# EAGLE design blumote (EAGLE 5.07)
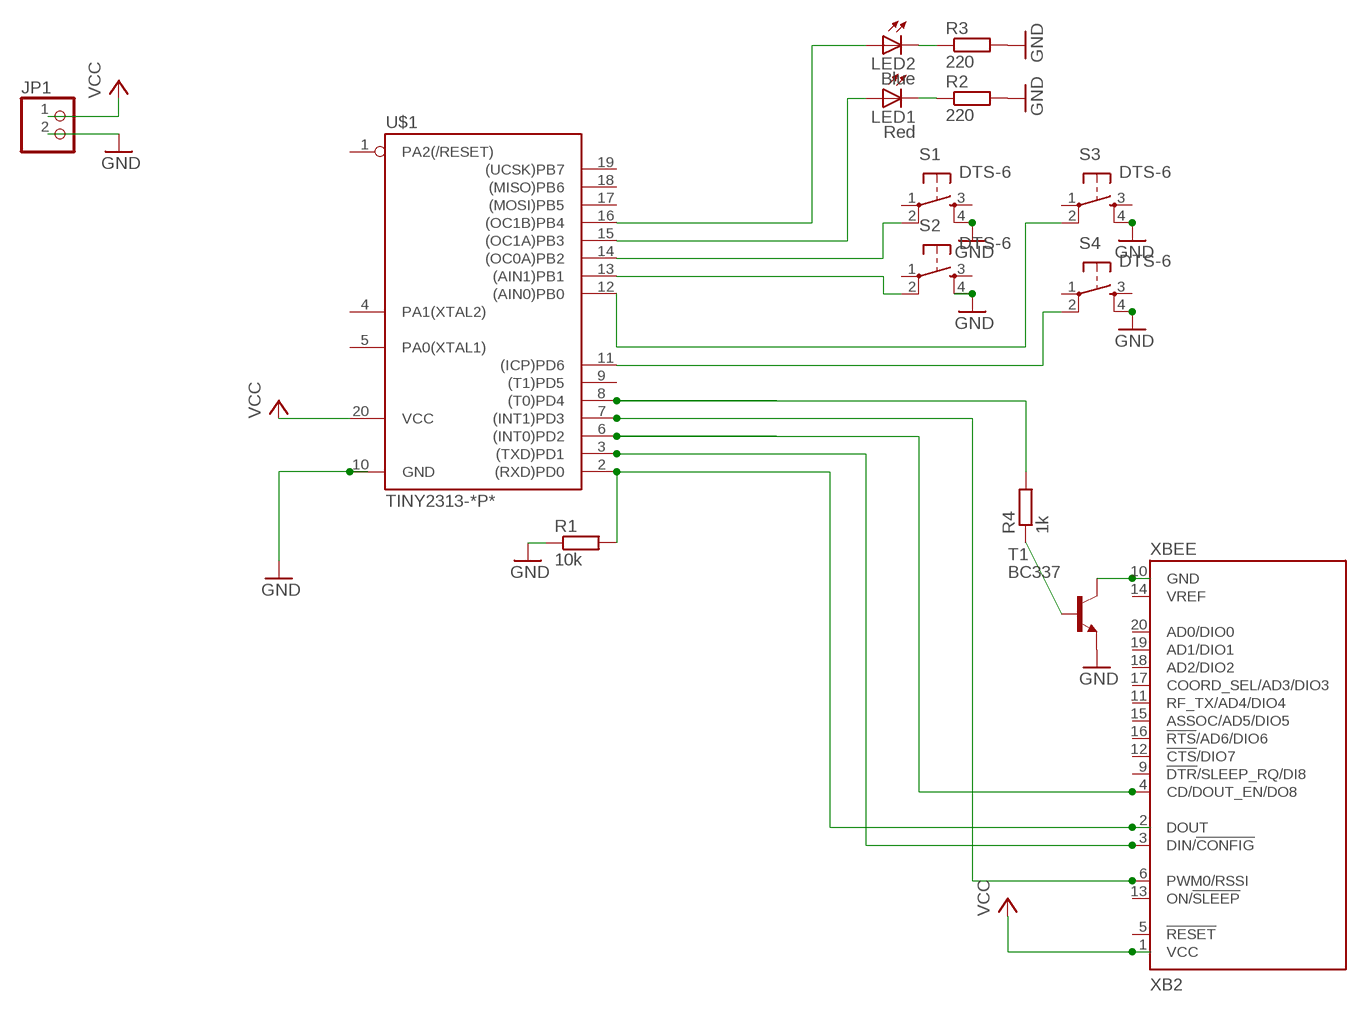
[diagram p0: schematic, sheet 1]

## Parts
JP1  PINHD-1X2  [1X02]
LED1  Red  LED3MM  [LED3MM]
LED2  Blue  LED3MM  [LED3MM]
R1  10k  R-EU_0204/7  [0204/7]
R2  220  R-EU_0204/7  [0204/7]
R3  220  R-EU_0204/7  [0204/7]
R4  1k  R-EU_0204/7  [0204/7]
S1  DTS-6  [DTS-6]
S2  DTS-6  [DTS-6]
S3  DTS-6  [DTS-6]
S4  DTS-6  [DTS-6]
T1  BC337  [TO92]
U$1  TINY2313-*P*  [DIL20]
XB2  XBEE  [XBEE]

## Nets
GND: JP1.2 R1.1 R2.2 R3.2 S1.4 S2.4 S3.4 S4.4 T1.1(E) U$1.10(GND)
N$1: U$1.3((TXD)PD1) XB2.3(DIN/!CONFIG)
N$2: R1.2 U$1.2((RXD)PD0) XB2.2(DOUT)
N$4: S1.2 U$1.14((OC0A)PB2)
N$5: R4.1 T1.2(B)
N$6: LED1.K(C) R2.1
N$7: LED2.A U$1.16((OC1B)PB4)
N$8: T1.3(C) XB2.10(GND)
N$9: LED1.A U$1.15((OC1A)PB3)
N$10: S4.2 U$1.11((ICP)PD6)
N$11: U$1.7((INT1)PD3) XB2.6(PWM0/RSSI)
N$12: LED2.K(C) R3.1
N$13: U$1.6((INT0)PD2) XB2.4(CD/DOUT_EN/DO8)
N$14: S3.2 U$1.12((AIN0)PB0)
N$15: S2.2 U$1.13((AIN1)PB1)
N$16: R4.2 U$1.8((T0)PD4)
VCC: JP1.1 U$1.20(VCC) XB2.1(VCC)
Unconnected: S1.1 S1.3 S2.1 S2.3 S3.1 S3.3 S4.1 S4.3 U$1.1(PA2(/RESET)) U$1.4(PA1(XTAL2)) U$1.5(PA0(XTAL1)) U$1.9((T1)PD5) U$1.17((MOSI)PB5) U$1.18((MISO)PB6) U$1.19((UCSK)PB7) XB2.5(!RESET) XB2.9(!DTR!/SLEEP_RQ/DI8) XB2.11(RF_TX/AD4/DIO4) XB2.12(!CTS!/DIO7) XB2.13(ON/!SLEEP) XB2.14(VREF) XB2.15(ASSOC/AD5/DIO5) XB2.16(!RTS!/AD6/DIO6) XB2.17(COORD_SEL/AD3/DIO3) XB2.18(AD2/DIO2) XB2.19(AD1/DIO1) XB2.20(AD0/DIO0)

## Library data of the parts
JP1 = pinhead:PINHD-1X2: PIN HEADER
LED1 LED2 = led:LED: LED OSRAM: - CHIPLED LG R971, LG N971, LY N971, LG Q971, LY Q971, LO R971, LY R971 LH N974, LH R974 LS Q976, LO Q976, LY Q976 LO Q996 - Hyper CHIPLED LW Q18S LB Q993, LB Q99A, LB R99A - SideLED LS A670, LO A670, LY A670, LG A670, LP A670 LB A673, LV A673, LT A673, LW A673 LH A674 LY A675 LS A676, LA A676, LO A676, LY A676, LW A676 LS A679, LY A679, LG A679 - Hyper Micro SIDELED® LS Y876, LA Y876, LO Y876, LY Y876 LT Y87S - SmartLED LW L88C, LW L88S LB L89C, LB L89S, LG L890 LS L89K, LO L89K, LY L89K LS L896, LA L896, LO L896, LY L896 - TOPLED LS T670, LO T670, LY T670, LG T670, LP T670 LSG T670, LSP T670, LSY T670, LOP T670, LYG T670 LG T671, LOG T671, LSG T671 LB T673, LV T673, LT T673, LW T673 LH T674 LS T676, LA T676, LO T676, LY T676, LB T676, LH T676, LSB T676, LW T676 LB T67C, LV T67C, LT T67C, LS T67K, LO T67K, LY T67K, LW E67C LS E67B, LA E67B, LO E67B, LY E67B, LB E67C, LV E67C, LT E67C LW T67C LS T679, LY T679, LG T679 LS T770, LO T770, LY T770, LG T770, LP T770 LB T773, LV T773, LT T773, LW T773 LH T774 LS E675, LA E675, LY E675, LS T675 LS T776, LA T776, LO T776, LY T776, LB T776 LHGB T686 LT T68C, LB T68C - Hyper Mini TOPLED® LB M676 - Mini TOPLED Santana® LG M470 LS M47K, LO M47K, LY M47K Source: http://www.osram.convergy.de LUXEON: - LUMILED® LXK2-PW12-R00, LXK2-PW12-S00, LXK2-PW14-U00, LXK2-PW14-V00 LXK2-PM12-R00, LXK2-PM12-S00, LXK2-PM14-U00 LXK2-PE12-Q00, LXK2-PE12-R00, LXK2-PE12-S00, LXK2-PE14-T00, LXK2-PE14-U00 LXK2-PB12-K00, LXK2-PB12-L00, LXK2-PB12-M00, LXK2-PB14-N00, LXK2-PB14-P00, LXK2-PB14-Q00 LXK2-PR12-L00, LXK2-PR12-M00, LXK2-PR14-Q00, LXK2-PR14-R00 LXK2-PD12-Q00, LXK2-PD12-R00, LXK2-PD12-S00 LXK2-PH12-R00, LXK2-PH12-S00 LXK2-PL12-P00, LXK2-PL12-Q00, LXK2-PL12-R00 Source: www.luxeon.com KINGBRIGHT: KA-3528ASYC Source: www.kingbright.com
R1 R4 = resistor:R-EU_: RESISTOR, European symbol
R2 R3 = rcl:R-EU_: RESISTOR, European symbol
S1-S4 = switch-tact:DTS-6
T1 = transistor:BC337: NPN TRANSISTOR
U$1 = avr-6:TINY2313*: Atmel Tiny2313 2K Flash, 128 bytes EEPROM, 128 bytes RAM
XB2 = maxstream:XBEE: XBee (TM) /XBee-PRO(TM) OEM RF Modules Source: MaxStream, Inc. xbee_productmanual.pdf

## Board
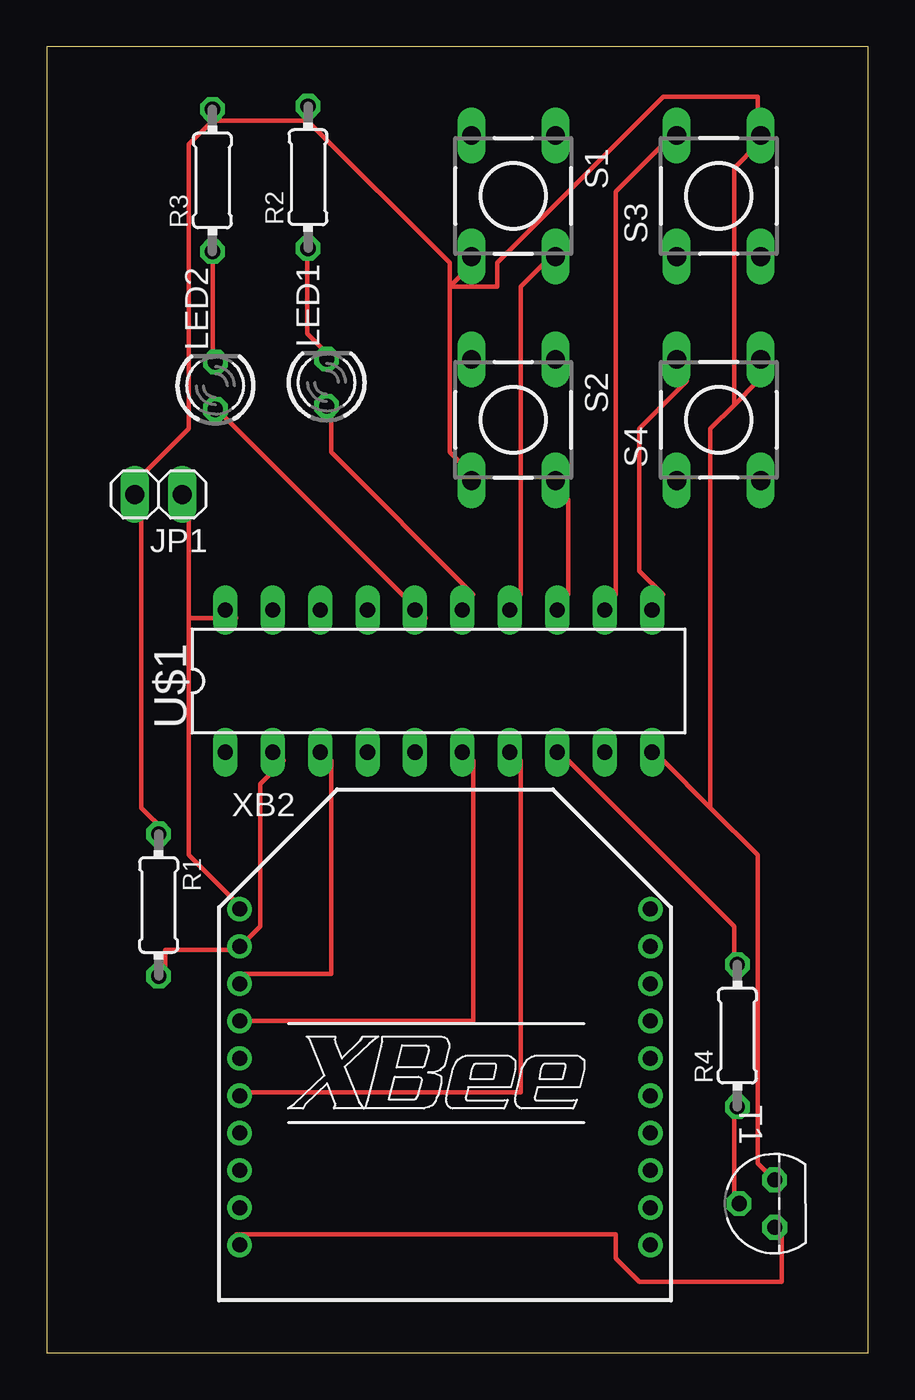
[diagram p1: board, top side]

Size 44 x 70 mm. Coordinates in mm from the lower left corner, seen from the top.
Outline: 0,0 44,0 44,70 0,70 0,0
Copper layers (1*16): Top 0.035mm / dielectric 1.5mm / Bottom 0.035mm
Design rules "default *": minimum track width 10mil, minimum drill 24mil, track to track 8mil, track to pad 8mil, pad to pad 8mil, via to via 8mil, smd to smd 8mil, copper to edge 40mil, drill to drill 8mil, minimum pad ring 10mil, minimum via ring 8mil, stop-mask expansion 4mil, vias tented up to drill 0mil, thermal gap 10mil

### Footprints (pad centres in the part's own frame; a part is rotated, then mirrored left to right if it is on the bottom)
1X02 = drill 1.016 long: 1 -1.27,0; 2 1.27,0
LED3MM = drill 0.813 octagon: A -1.27,0; K 1.27,0
0204/7 = drill 0.813 octagon: 1 -3.81,0; 2 3.81,0
DTS-6 = drill 1 long: 1 -3.25,2.25; 2 3.25,2.25; 3 -3.25,-2.25; 4 3.25,-2.25
TO92 = drill 0.813 octagon: 1 1.27,0; 2 0,1.905; 3 -1.27,0
DIL20 = drill 0.813 long: 1 -11.43,-3.81; 2 -8.89,-3.81; 3 -6.35,-3.81; 4 -3.81,-3.81; 5 -1.27,-3.81; 6 1.27,-3.81; 7 3.81,-3.81; 8 6.35,-3.81; 9 8.89,-3.81; 10 11.43,-3.81; 11 11.43,3.81; 12 8.89,3.81; 13 6.35,3.81; 14 3.81,3.81; 15 1.27,3.81; 16 -1.27,3.81; 17 -3.81,3.81; 18 -6.35,3.81; 19 -8.89,3.81; 20 -11.43,3.81
XBEE = drill 0.8 pad 1.27 round: 1 -11,9; 2 -11,7; 3 -11,5; 4 -11,3; 5 -11,1; 6 -11,-1; 7 -11,-3; 8 -11,-5; 9 -11,-7; 10 -11,-9; 11 11,-9; 12 11,-7; 13 11,-5; 14 11,-3; 15 11,-1; 16 11,1; 17 11,3; 18 11,5; 19 11,7; 20 11,9

### Placement (x,y rotation side)
JP1  6,46 180 top
LED1  15,52 90 top
LED2  9.04,51.83 90 top
R1  6,24 270 top
R2  14,63 90 top
R3  8.88,62.83 90 top
R4  37,17 90 top
S1  25,62 270 top
S2  25,50 270 top
S3  36,62 90 top
S4  36,50 90 top
T1  39,8 90.1 top
U$1  21,36 0 top
XB2  21.34,14.78 0 top

### Tracks (layer width: path | path; a pad name or v marks a point on that pad's centre or on a via)
GND
  Top 0.254: R1.1 6.35,27.94 5.08,29.21 5.08,45.72 JP1.2 5.08,46.99 7.62,49.53 7.62,64.77 8.89,66.04 | 8.89,66.04 13.97,66.04 | 13.97,66.04 13.97,67.31 R2.2 | 21.59,57.15 21.59,48.26 22.86,46.99 S2.4 | 21.59,57.15 22.86,58.42 S1.4 | 13.97,66.04 21.59,58.42 21.59,57.15 | 8.89,66.04 R3.2 | 35.56,29.21 33.02,31.75 U$1.10 | 35.56,29.21 38.1,26.67 38.1,10.16 39.37,8.89 T1.1 | 36.83,50.8 35.56,49.53 35.56,29.21 | 36.83,50.8 38.1,52.07 S4.4 | 36.83,50.8 36.83,63.5 38.1,64.77 S3.4 38.1,66.04 38.1,67.31 33.02,67.31 24.13,58.42 24.13,57.15 21.59,57.15
N$1
  Top 0.254: XB2.3 10.16,20.32 15.24,20.32 15.24,31.75 U$1.3
N$2
  Top 0.254: 10.16,21.59 6.35,21.59 6.35,20.32 R1.2 | 10.16,21.59 11.43,22.86 11.43,30.48 12.7,31.75 U$1.2 | 10.16,21.59 XB2.2
N$4
  Top 0.254: U$1.14 25.4,40.64 25.4,57.15 26.67,58.42 S1.2
N$5
  Top 0.254: R4.1 36.83,12.7 36.83,7.62 T1.2
N$6
  Top 0.254: LED1.K 15.24,53.34 13.97,54.61 13.97,59.69 R2.1
N$7
  Top 0.254: LED2.A 8.89,50.8 20.32,39.37 U$1.16
N$8
  Top 0.254: XB2.10 10.16,6.35 30.48,6.35 30.48,5.08 31.75,3.81 39.37,3.81 39.37,6.35 T1.3
N$9
  Top 0.254: U$1.15 22.86,40.64 15.24,48.26 15.24,50.8 LED1.A
N$10
  Top 0.254: U$1.11 33.02,40.64 31.75,41.91 31.75,49.53 34.29,52.07 S4.2
N$11
  Top 0.254: XB2.6 10.16,13.97 25.4,13.97 25.4,31.75 U$1.7
N$12
  Top 0.254: R3.1 8.89,58.42 8.89,53.34 LED2.K
N$13
  Top 0.254: 10.16,17.78 XB2.4 22.86,17.78 22.86,31.75 U$1.6
N$14
  Top 0.254: U$1.12 30.48,40.64 30.48,62.23 33.02,64.77 S3.2
N$15
  Top 0.254: U$1.13 27.94,40.64 27.94,45.72 S2.2
N$16
  Top 0.254: U$1.8 27.94,31.75 36.83,22.86 36.83,20.32 R4.2
VCC
  Top 0.254: 7.62,39.37 7.62,45.72 JP1.1 | 7.62,39.37 7.62,26.67 10.16,24.13 XB2.1 | 7.62,39.37 10.16,39.37 U$1.20